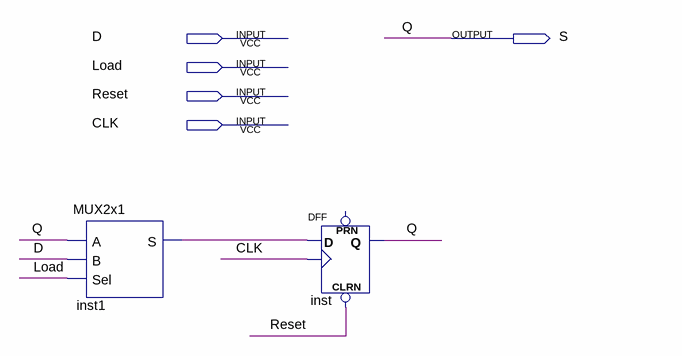
[diagram p0: schematic sheet]
// Quartus schematic REG1.bdf as structural Verilog: 2 symbols, 5 pins
module REG1 (
  input  D,
  input  Load,
  input  Reset,
  input  CLK,
  output S
);

  wire inst1_s;

  MUX2x1 inst1 (.A(S), .B(D), .Sel(Load), .S(inst1_s));
  DFF inst (.CLRN(Reset), .CLK(CLK), .D(inst1_s), .Q(S));  // open: PRN

  // Other names for the same wires on the sheet: Q = S
endmodule
